# EasyEDA schematic 1-Schematic_USB_WAVER.json
TITLE: Sheet_1; REV: 1.0; Date: 2022-12-25; Sheet: 1/1; Drawn By: maarnotto; Company: Your Company
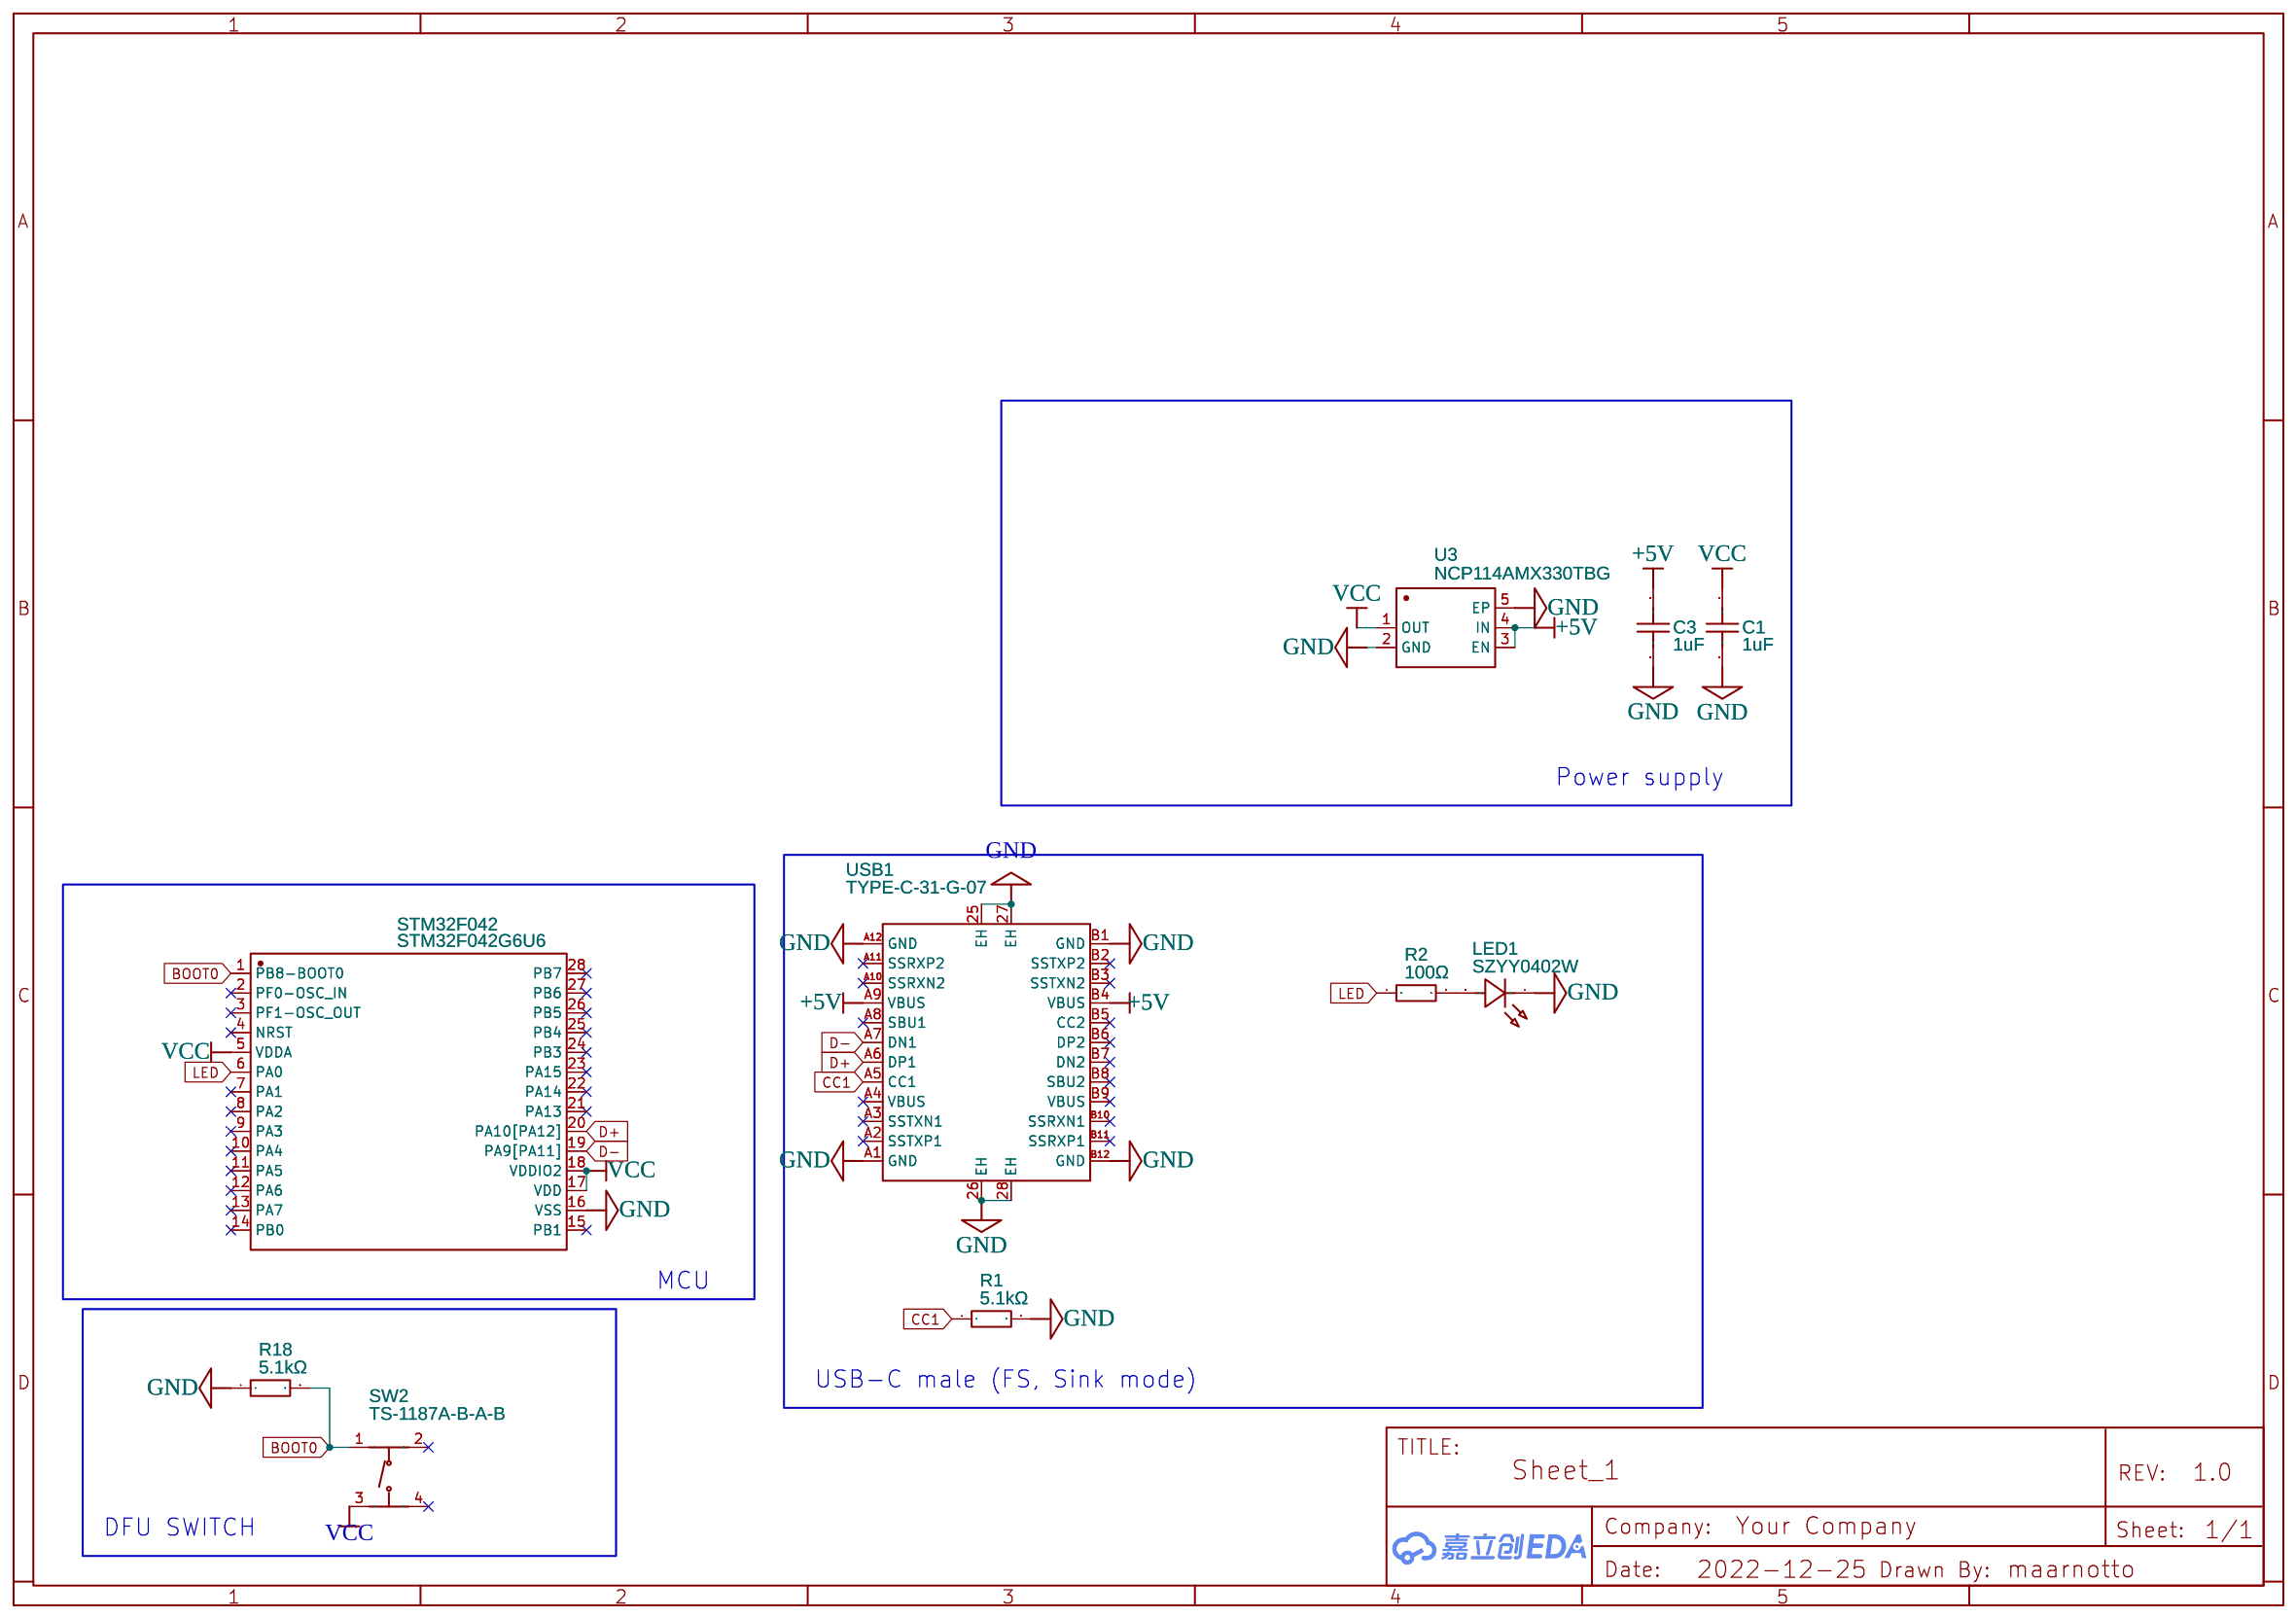
[diagram p0: schematic sheet]

## Parts
C1  1uF  [C0402]
C3  1uF  [C0402]
LED1  SZYY0402W  [LED0402-RD_WHITE]
R1  5.1kΩ  [R0402]
R2  100Ω  [R0402]
R18  5.1kΩ  [R0402]
STM32F042  STM32F042G6U6  [UFQFPN-28_L4.0-W4.0-P0.50-BL]
SW2  TS-1187A-B-A-B  [SW-SMD_4P-L5.1-W5.1-P3.70-LS6.5-TL-2]
U3  NCP114AMX330TBG  [UDFN-4_L1.0-W1.0-P0.65-BL-EP]
USB1  TYPE-C-31-G-07  [USB-C-SMD_TYPE-C-31-G-07]

## Library data of the parts
C1 C3 = C_0603_US: Contributor: LCEDA_Lib
LED1 = SZYY0402W: Contributor: lcsc; Supplier: LCSC; Supplier Part: C434448; Manufacturer: yongyu(永裕光电); JLCPCB Part Class: Extended Part
R1 R18 = 0402WGF5101TCE: Supplier: LCSC; Manufacturer: UNI-ROYAL(厚声); Supplier Part: C25905; JLCPCB Part Class: Basic Part
R2 = 0402WGF1000TCE: Supplier: LCSC; Manufacturer: UNI-ROYAL(厚声); Supplier Part: C25076; JLCPCB Part Class: Basic Part
STM32F042 = STM32F042G6U6: Contributor: LCSC; Supplier: LCSC; Supplier Part: C961597; Manufacturer: ST(意法半导体); JLCPCB Part Class: Extended Part
SW2 = TS-1187A-B-A-B: Contributor: LCSC; Supplier: LCSC; Supplier Part: C318884; Manufacturer: XKB Connectivity(中国星坤); JLCPCB Part Class: Basic Part
U3 = NCP114AMX330TBG: Contributor: LCSC; Supplier: LCSC; Supplier Part: C603494; Manufacturer: onsemi(安森美); JLCPCB Part Class: Extended Part
USB1 = TYPE-C-31-G-07: Contributor: LCSC; Supplier: LCSC; Supplier Part: C530607; Manufacturer: 韩国韩荣; JLCPCB Part Class: Extended Part

## Nets
+5V: C3.2 U3.3(EN) U3.4(IN) USB1.A9(VBUS) USB1.B4(VBUS)
GND: C1.1 C3.1 LED1.1(K) R1.2 R18.1 STM32F042.16(VSS) U3.2(GND) U3.5(EP) USB1.25(EH) USB1.26(EH) USB1.27(EH) USB1.28(EH) USB1.A1(GND) USB1.A12(GND) USB1.B1(GND) USB1.B12(GND)
VCC: C1.2 STM32F042.5(VDDA) STM32F042.17(VDD) STM32F042.18(VDDIO2) SW2.3(C) U3.1(OUT)
BOOT0: R18.2 STM32F042.1(PB8-BOOT0) SW2.1(A)
CC1: R1.1 USB1.A5(CC1)
D+: STM32F042.20(PA10[PA12]) USB1.A6(DP1)
D-: STM32F042.19(PA9[PA11]) USB1.A7(DN1)
LED: R2.1 STM32F042.6(PA0)
Net-(LED1-2): LED1.2(A) R2.2

Not connected (* = marked no-connect by the designer): STM32F042 2(PF0-OSC_IN)* 3(PF1-OSC_OUT)* 4(NRST)* 7(PA1)* 8(PA2)* 9(PA3)* 10(PA4)* 11(PA5)* 12(PA6)* 13(PA7)* 14(PB0)* 15(PB1)* 21(PA13)* 22(PA14)* 23(PA15)* 24(PB3)* 25(PB4)* 26(PB5)* 27(PB6)* 28(PB7)*; SW2 2(B)* 4(D)*; USB1 A2(SSTXP1)* A3(SSTXN1)* A4(VBUS)* A8(SBU1)* A10(SSRXN2)* A11(SSRXP2)* B2(SSTXP2)* B3(SSTXN2)* B5(CC2)* B6(DP2)* B7(DN2)* B8(SBU2)* B9(VBUS)* B10(SSRXN1)* B11(SSRXP1)*

## Notes on the sheet
- Power supply
- MCU
- USB-C male (FS, Sink mode)
- DFU SWITCH
